# EAGLE schematic licthla (EAGLE 7.5.0)
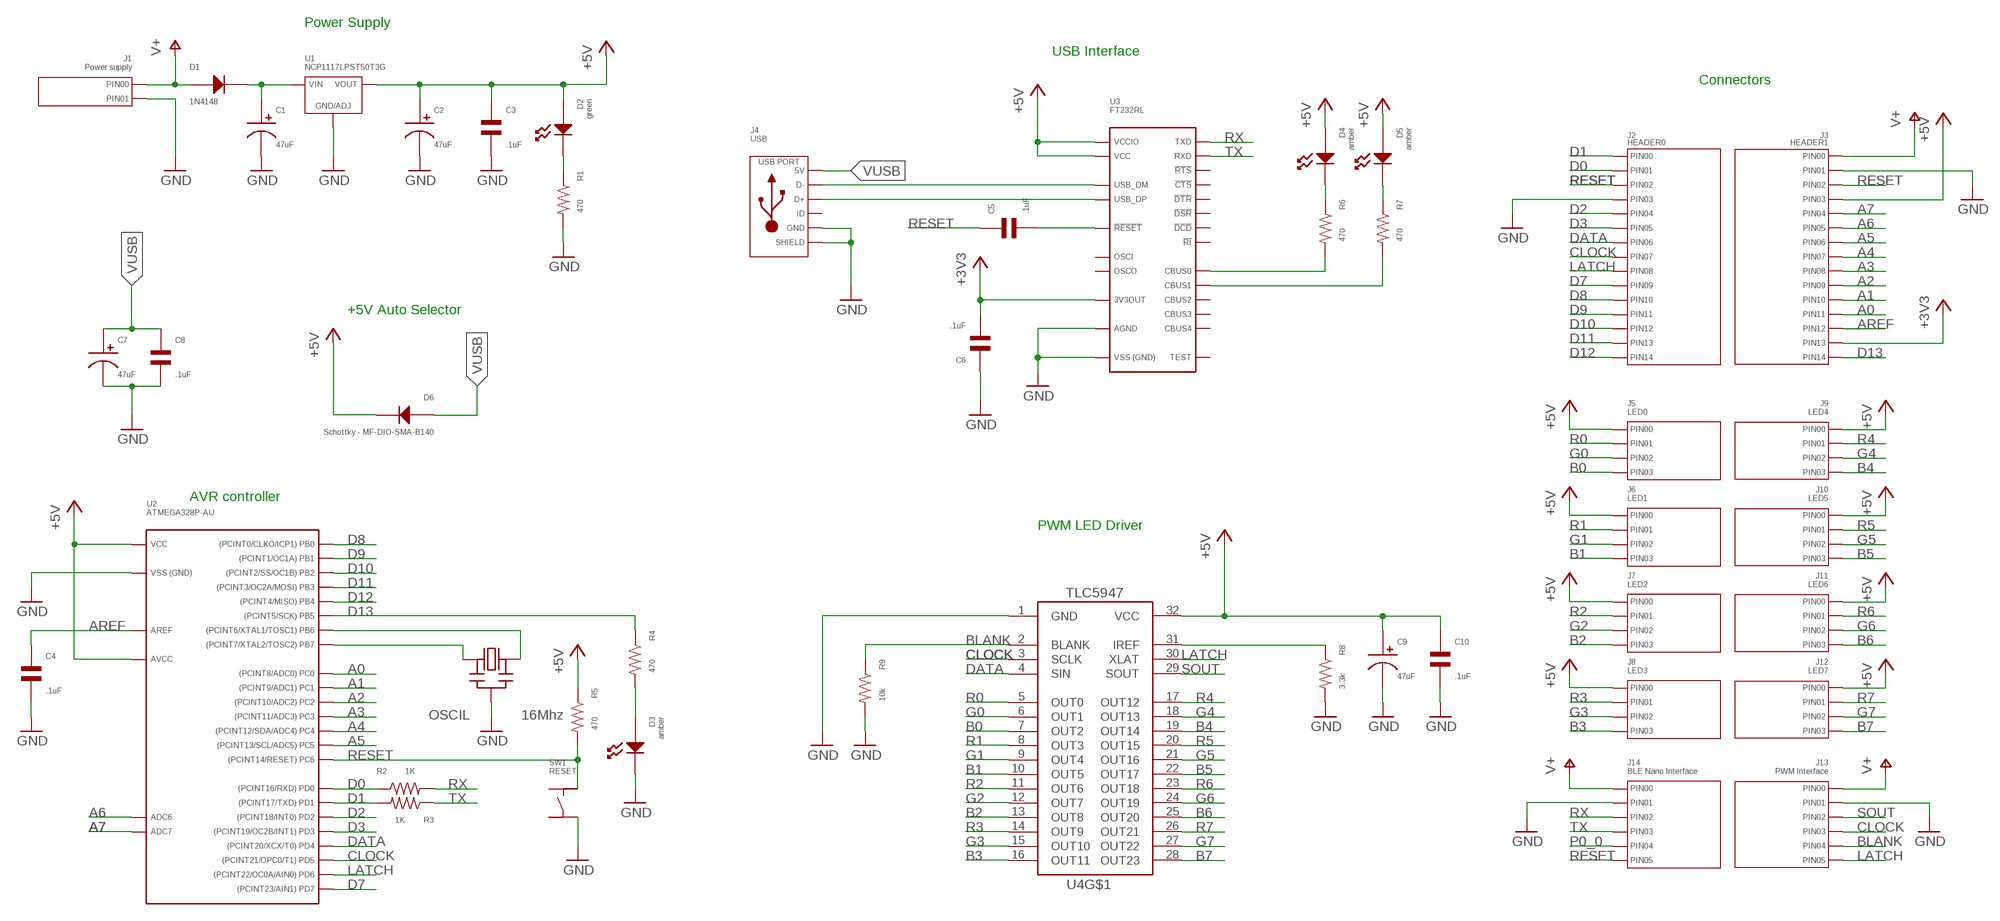
[diagram p0: schematic, sheet 1]

## Parts
C1  47uF  CAPACITOR_P_6.3MM  [CP6.3MM]
C2  47uF  CAPACITOR_P_6.3MM  [CP6.3MM]
C3  .1uF  CAPACITOR_NP_0402  [C0402]
C4  .1uF  CAPACITOR_NP_0402  [C0402]
C5  .1uF  CAPACITOR_NP_0402  [C0402]
C6  .1uF  CAPACITOR_NP_0402  [C0402]
C7  47uF  CAPACITOR_P_6.3MM  [CP6.3MM]
C8  .1uF  CAPACITOR_NP_0402  [C0402]
C9  47uF  CAPACITOR_P_6.3MM  [CP6.3MM]
C10  .1uF  CAPACITOR_NP_0402  [C0402]
D1  1N4148  DIODE_SOD-123  [SOD-123]
D2  green  LED_SINGLE_0805  [LED0805]
D3  amber  LED_SINGLE_0805  [LED0805]
D4  amber  LED_SINGLE_0805  [LED0805]
D5  amber  LED_SINGLE_0805  [LED0805]
D6  Schottky - MF-DIO-SMA-B140  DIODE_SMA  [SMA]
J1  Power supply  HEADER_01X02_PTH_2.54MM  [PTH_2.54MM_01X02]
J2  HEADER0  HEADER_01X15_PTH_2.54MM  [PTH_2.54MM_01X15]
J3  HEADER1  HEADER_01X15_PTH_2.54MM  [PTH_2.54MM_01X15]
J4  USB  USB_MICRO_RIGHT  [MICROUSB-RIGHT]
J5  LED0  HEADER_01X04_PTH_2.54MM  [PTH_2.54MM_01X04]
J6  LED1  HEADER_01X04_PTH_2.54MM  [PTH_2.54MM_01X04]
J7  LED2  HEADER_01X04_PTH_2.54MM  [PTH_2.54MM_01X04]
J8  LED3  HEADER_01X04_PTH_2.54MM  [PTH_2.54MM_01X04]
J9  LED4  HEADER_01X04_PTH_2.54MM  [PTH_2.54MM_01X04]
J10  LED5  HEADER_01X04_PTH_2.54MM  [PTH_2.54MM_01X04]
J11  LED6  HEADER_01X04_PTH_2.54MM  [PTH_2.54MM_01X04]
J12  LED7  HEADER_01X04_PTH_2.54MM  [PTH_2.54MM_01X04]
J13  PWM Interface  HEADER_01X06_PTH_2.54MM  [PTH_2.54MM_01X06]
J14  BLE Nano Interface  HEADER_01X06_PTH_2.54MM  [PTH_2.54MM_01X06]
OSCIL  16Mhz  CERMOSCILL-AWCSR  [AWCSR]
R1  470  RESISTOR_0805  [R0805]
R2  1K  RESISTOR_0805  [R0805]
R3  1K  RESISTOR_0805  [R0805]
R4  470  RESISTOR_0805  [R0805]
R5  470  RESISTOR_0805  [R0805]
R6  470  RESISTOR_0805  [R0805]
R7  470  RESISTOR_0805  [R0805]
R8  3.3k  RESISTOR_0805  [R0805]
R9  10k  RESISTOR_0805  [R0805]
SW1  RESET  TACT_6MM  [TACT6MM]
U1  NCP1117LPST50T3G  [SOT-223-3]
U2  ATMEGA328P-AU  [TQFP32]
U3  FT232RL  [SSOP28]
U4  TLC5947-DAP  [HTSSOP32DAP]

## Nets
+3V3: C6.P$2 J3.P$14(PIN13) U3.P$17(3V3OUT)
+5V: C2.P$1 C3.P$1 C9.P$1 C10.P$1 D2.ANODE D4.ANODE D5.ANODE D6.CATHODE J3.P$4(PIN3) J5.P$1(PIN0) J6.P$1(PIN0) J7.P$1(PIN0) J8.P$1(PIN0) J9.P$1(PIN0) J10.P$1(PIN0) J11.P$1(PIN0) J12.P$1(PIN0) R5.P$1 U1.P$1(VOUT) U1.P$3(VOUT) U2.P$4(VCC) U2.P$6(VCC) U2.P$18(AVCC) U3.P$4(VCCIO) U3.P$20(VCC) U4.32(VCC)
A0: J3.P$12(PIN11) U2.P$23(PC0)
A1: J3.P$11(PIN10) U2.P$24(PC1)
A2: J3.P$10(PIN9) U2.P$25(PC2)
A3: J3.P$9(PIN8) U2.P$26(PC3)
A4: J3.P$8(PIN7) U2.P$27(PC4)
A5: J3.P$7(PIN6) U2.P$28(PC5)
A6: J3.P$6(PIN5) U2.P$19(ADC6)
A7: J3.P$5(PIN4) U2.P$22(ADC7)
AREF: C4.P$1 J3.P$13(PIN12) U2.P$20(AREF)
B0: J5.P$4(PIN3) U4.7(OUT2)
B1: J6.P$4(PIN3) U4.10(OUT5)
B2: J7.P$4(PIN3) U4.13(OUT8)
B3: J8.P$4(PIN3) U4.16(OUT11)
B4: J9.P$4(PIN3) U4.19(OUT14)
B5: J10.P$4(PIN3) U4.22(OUT17)
B6: J11.P$4(PIN3) U4.25(OUT20)
B7: J12.P$4(PIN3) U4.28(OUT23)
BLANK: J13.P$5(PIN4) R9.P$1 U4.2(BLANK)
CLOCK: J2.P$8(PIN7) J13.P$4(PIN3) U2.P$9(PD5) U4.3(SCLK)
D0: J2.P$2(PIN1) R2.P$1 U2.P$30(PD0)
D1: J2.P$1(PIN0) R3.P$2 U2.P$31(PD1)
D2: J2.P$5(PIN4) U2.P$32(PD2)
D3: J2.P$6(PIN5) U2.P$1(PD3)
D7: J2.P$10(PIN9) U2.P$11(PD7)
D8: J2.P$11(PIN10) U2.P$12(PB0)
D9: J2.P$12(PIN11) U2.P$13(PB1)
D10: J2.P$13(PIN12) U2.P$14(PB2)
D11: J2.P$14(PIN13) U2.P$15(PB3)
D12: J2.P$15(PIN14) U2.P$16(PB4)
D13: J3.P$15(PIN14) R4.P$1 U2.P$17(PB5)
DATA: J2.P$7(PIN6) U2.P$2(PD4) U4.4(SIN)
G0: J5.P$3(PIN2) U4.6(OUT1)
G1: J6.P$3(PIN2) U4.9(OUT4)
G2: J7.P$3(PIN2) U4.12(OUT7)
G3: J8.P$3(PIN2) U4.15(OUT10)
G4: J9.P$3(PIN2) U4.18(OUT13)
G5: J10.P$3(PIN2) U4.21(OUT16)
G6: J11.P$3(PIN2) U4.24(OUT19)
G7: J12.P$3(PIN2) U4.27(OUT22)
GND: C1.P$2 C2.P$2 C3.P$2 C4.P$2 C6.P$1 C7.P$2 C8.P$2 C9.P$2 C10.P$2 D3.CATHODE J1.P$1(PIN1) J2.P$4(PIN3) J3.P$2(PIN1) J4.5(GND) J4.S1(SLD) J4.S2(SLD) J4.S3(SLD) J4.S4(SLD) J4.S5(SLD) J4.S6(SLD) J4.S7(SLD) J4.S8(SLD) J13.P$2(PIN1) J14.P$2(PIN1) OSCIL.2(GND) R1.P$2 R8.P$2 R9.P$2 SW1.P$4 U1.P$2(GND/ADJ) U2.P$3(GND) U2.P$5(GND) U2.P$21(GND) U3.P$7(GND) U3.P$18(GND) U3.P$21(GND) U3.P$25(AGND) U4.1(GND)
LATCH: J2.P$9(PIN8) J13.P$6(PIN5) U2.P$10(PD6) U4.30(XLAT)
N$1: D2.CATHODE R1.P$1
N$2: J4.2(D-) U3.P$16(USBDM)
N$3: J4.3(D+) U3.P$15(USBDP)
N$4: C1.P$1 D1.CATHODE U1.P$4(VIN)
N$5: OSCIL.1(IN) U2.P$8(PB7)
N$6: OSCIL.3(OUT) U2.P$7(PB6)
N$7: D3.ANODE R4.P$2
N$8: C5.P$2 U3.P$19(!RESET)
N$9: R8.P$1 U4.31(IREF)
N$11: D4.CATHODE R6.P$1
N$12: D5.CATHODE R7.P$1
N$13: R6.P$2 U3.P$23(CBUS0)
N$14: R7.P$2 U3.P$22(CBUS1)
P0_0: J14.P$5(PIN4)
R0: J5.P$2(PIN1) U4.5(OUT0)
R1: J6.P$2(PIN1) U4.8(OUT3)
R2: J7.P$2(PIN1) U4.11(OUT6)
R3: J8.P$2(PIN1) U4.14(OUT9)
R4: J9.P$2(PIN1) U4.17(OUT12)
R5: J10.P$2(PIN1) U4.20(OUT15)
R6: J11.P$2(PIN1) U4.23(OUT18)
R7: J12.P$2(PIN1) U4.26(OUT21)
RESET: C5.P$1 J2.P$3(PIN2) J3.P$3(PIN2) J14.P$6(PIN5) R5.P$2 SW1.P$2 U2.P$29(PC6)
RX: J14.P$3(PIN2) R2.P$2 U3.P$1(TXD)
SOUT: J13.P$3(PIN2) U4.29(SOUT)
TX: J14.P$4(PIN3) R3.P$1 U3.P$5(RXD)
V+: D1.ANODE J1.P$2(PIN0) J3.P$1(PIN0) J13.P$1(PIN0) J14.P$1(PIN0)
VUSB: C7.P$1 C8.P$1 D6.ANODE J4.1(5V)
Unconnected: J4.4(ID) SW1.P$1 SW1.P$3 U3.P$2(!DTR) U3.P$3(!RTS) U3.P$6(!RI) U3.P$9(!DSR) U3.P$10(!DCD) U3.P$11(!CTS) U3.P$12(CBUS4) U3.P$13(CBUS2) U3.P$14(CBUS3) U3.P$26(TEST) U3.P$27(OSCI) U3.P$28(OSCO) U4.EXP(PAD)

## Notes on the sheet
- Power Supply
- USB Interface
- Connectors
- +5V Auto Selector
- AVR controller
- PWM LED Driver

## Library data of the parts
C1 C2 C7 C9 = MF_Passives:CAPACITOR_P: Library: MF_Passives Description: Device for Polarized Capacitors. Manufacture part number (MFG#), Voltage Rating, and Tolerance can be added via Attributes.; MFG#: N/A; TOLERANCE: N/A; VOTLAGE: N/A
C3-C6 C8 C10 = MF_Passives:CAPACITOR_NP: Library: MF_Passives Description: Device for Non-Polarized Capacitors. Manufacture part number (MFG#), Voltage, Temperature Coefficient, and Tolerance can be added via Attributes.; MFG#: N/A; TEMP_COF: N/A; TOLERANCE: N/A; VOLTAGE: N/A
D1 D6 = MF_Discrete_Semiconductor:DIODE: Library: MF_Discrete_Semiconductor Description: Device for Single Packaged Diodes. Manufacture part number (MFG#) can be added via Attributes.; MFG#: N/A
D2-D5 = MF_LEDs:LED_SINGLE: Library: MF_LEDs Description: Device for Single LED Packages. Manufacture part number (MFG#) can be added via Attributes.
J1 = MF_Connectors:HEADER_01X02: Library: MF_Connectors Description: Header Connector with 02 Positions and 01 Rows. Use the LABEL Attribute to label the pin on the schematic and PCB. You can remove the attributes on the PCB by using the SMASH function on the part and then deleting the text.
J2 J3 = MF_Connectors:HEADER_01X15: Library: MF_Connectors Description: Header Connector with 15 Positions and 01 Rows. Use the LABEL Attribute to label the pin on the schematic and PCB. You can remove the attributes on the PCB by using the SMASH function on the part and then deleting the text.
J4 = MF_Connectors:USB: Library: MF_Connectors Description: 5 Pin USB Connectors. SLD is the shield connection. Usually tied to ground through a small ferrite bead.
J5-J12 = MF_Connectors:HEADER_01X04: Library: MF_Connectors Description: Header Connector with 04 Positions and 01 Rows. Use the LABEL Attribute to label the pin on the schematic and PCB. You can remove the attributes on the PCB by using the SMASH function on the part and then deleting the text.
J13 J14 = MF_Connectors:HEADER_01X06: Library: MF_Connectors Description: Header Connector with 6 Positions and 01 Rows. Use the LABEL Attribute to label the pin on the schematic and PCB. You can remove the attributes on the PCB by using the SMASH function on the part and then deleting the text.
OSCIL = adafruit:CERMOSCILL: Ceramic oscillator with built in capacitors such as ZTT-12MHz http://www.ladyada.net/library/eagle
R1-R9 = MF_Passives:RESISTOR: Library: MF_Passives Description: Device for Resistors. Manufacture part number (MFG#), Voltage, Tolerance, and Wattage Rating can be added via Attributes.; MFG#: N/A; TOLERANCE: N/A; VOLTAGE: N/A; WATTAGE: N/A
SW1 = MF_Switches:TACT: Library: MF_Switches Description: Device for Tact Switches. Manufacture part number (MFG#) can be added via Attributes.; MFG#: N/A
U1 = MF_IC_Power:NCP1117LP: Manufacturer Part #: NCP1117LP Manufacturer: ON Semiconductor Description: LDO Voltage Regulators
U2 = MF_IC_Digital:ATMEGA328P: Manufacturer Part #: ATMEGA328P Manufacturer: Atmel Description: 8-bit Microcontrollers - MCU 32KB In-system Flash 20MHz 1.8V-5.5V
U3 = MF_IC_Digital:FT232R: Manufacturer Part #: FT232R Manufacturer: FTDI Description: USB Interface IC USB to Serial UART Enhanced IC
U4 = adafruit:TLC5947